# Altium schematic sheet qspi-flash.SchDoc
size A
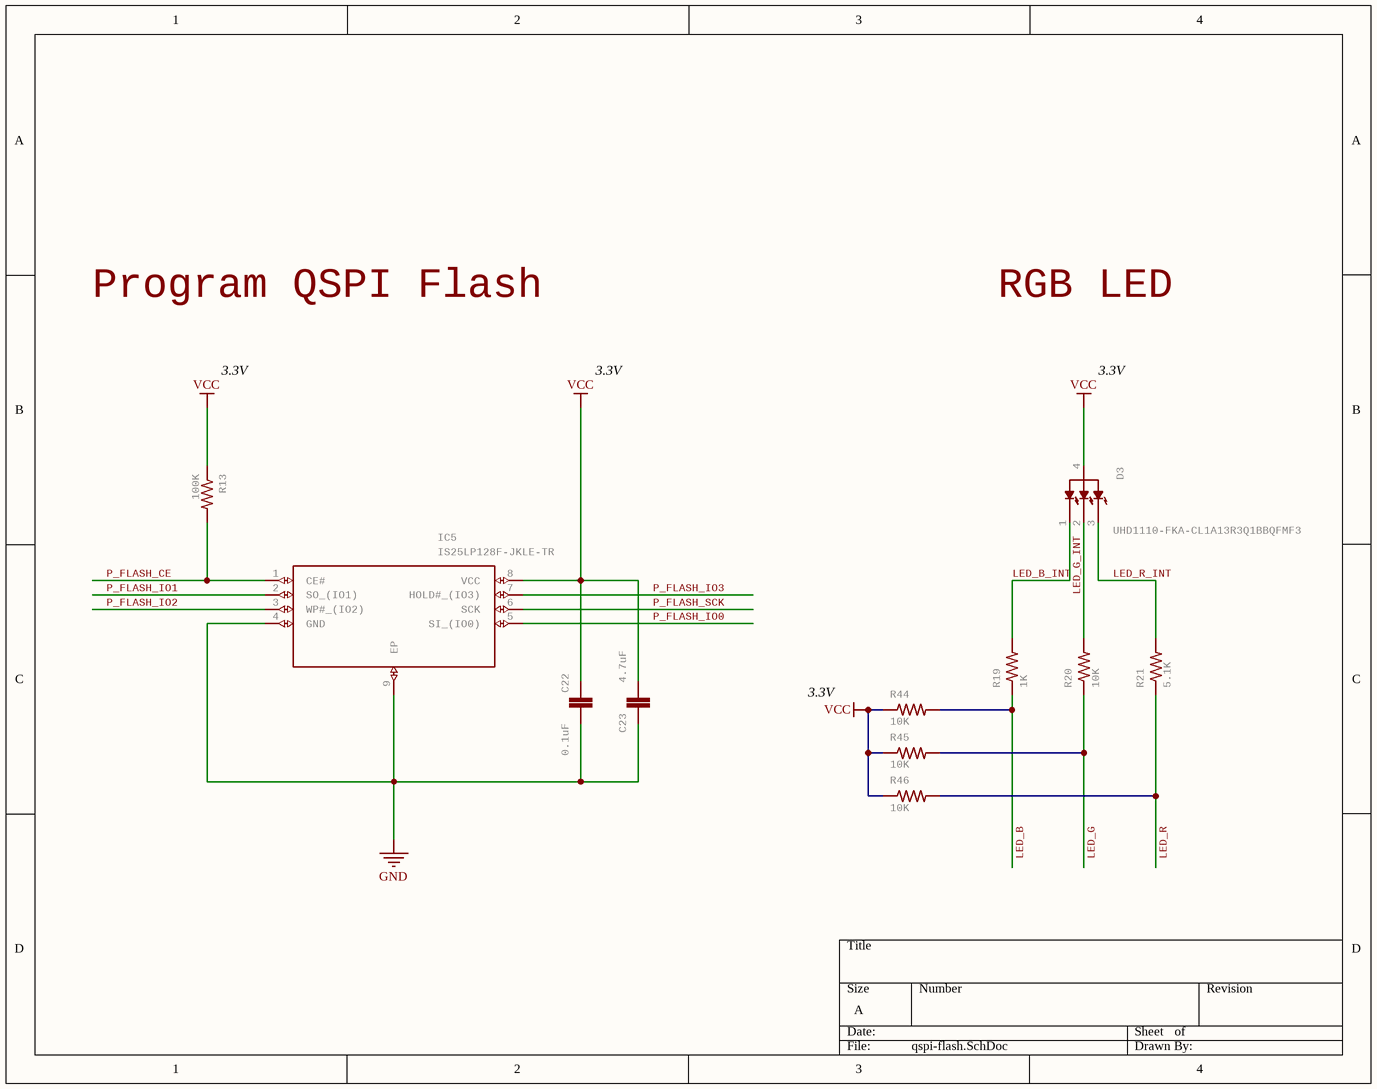
[diagram p0: qspi-flash.SchDoc]

## Parts
C22  0.1uF  [0402-CAP]
C23  4.7uF  [0402-CAP]
D3  UHD1110-FKA-CL1A13R3Q1BBQFMF3  [LED_UHD1110-FKA-CL1A13R3Q1BBQFMF3]
IC5  IS25LP128F-JKLE-TR  [SON127P500X595X80-9N]
R13  100K  [0402-RES]
R19  1K  [0402-RES]
R20  10K  [0402-RES]
R21  5.1K  [0402-RES]
R44  10K  [0402-RES]
R45  10K  [0402-RES]
R46  10K  [0402-RES]

## Nets
GND: C22.2 C23.1 IC5.4(GND) IC5.9(EP)
VCC: C22.1 C23.2 D3.4(ANODE) IC5.8(VCC) R13.1 R44.1 R45.1 R46.1
LED_B: R19.1 R44.2
LED_B_INT: D3.1(BLUE) R19.2
LED_G: R20.1 R45.2
LED_G_INT: D3.2(GREEN) R20.2
LED_R: R21.1 R46.2
LED_R_INT: D3.3(RED) R21.2
P_FLASH_CE: IC5.1(CE#) R13.2
P_FLASH_IO0: IC5.5(SI_(IO0))
P_FLASH_IO1: IC5.2(SO_(IO1))
P_FLASH_IO2: IC5.3(WP#_(IO2))
P_FLASH_IO3: IC5.7(HOLD#_(IO3))
P_FLASH_SCK: IC5.6(SCK)

## Notes on the sheet
- Program QSPI Flash
- RGB LED
- 3.3V

## Library data of the parts
C22 = C-EUC0201: CAPACITOR, European symbol; MPN: C0402C104Z4VAC; GateName_1: G$1; SymbolName_1: C-EU; POPULARITY: 0; LibraryName: rcl; DeviceSetName: C-EU; SPICEPREFIX: C; Part Number: C0402C104Z4VAC
C23 = CAP0402-CAP: CapacitorStandard 0603 ceramic capacitor, and 0.1" leaded capacitor.; MPN: JMK105BBJ475MV-F; GateName_1: G$1; SymbolName_1: CAP; DeviceName: 0402-CAP; LibraryName: sfe; DeviceSetName: CAP; Part Number: JMK105BBJ475MV-F
D3 = UHD1110-FKA-CL1A13R3Q1BBQFMF3: LED RGB SMD, SIZE 1 X 1 mm Check availability; GateName_1: G$1; MF: Cree Inc.; SymbolName_1: UHD1110-FKA-CL1A13R3Q1BBQFMF3; LibraryName: UHD1110-FKA-CL1A13R3Q1BBQFMF3; DeviceSetName: UHD1110-FKA-CL1A13R3Q1BBQFMF3; AVAILABILITY: In Stock; MP: UHD1110-FKA-CL1A13R3Q1BBQFMF3; MPN: UHD1110-FKA-CL1A13r3q1BBQFMF3; PACKAGE: 0404 Cree Inc.; PRICE: None; PURCHASE-URL: https://pricing.snapeda.com/search/part/UHD1110-FKA-CL1A13R3Q1BBQFMF3/?ref=eda; Part Number: UHD1110-FKA-CL1A13r3q1BBQFMF3
IC5 = IS25LP128F-JKLE-TR: NOR Flash 128M 2.3-3.6V 166Mhz Serial NOR Flash   Source:  Datasheet; MANUFACTURER_NAME: Integrated Silicon Solution Inc.; GateName_1: G$1; SymbolName_1: IS25LP128F-JKLE-TR; LibraryName: IS25LP128F-JKLE-TR; DeviceSetName: IS25LP128F-JKLE-TR; HEIGHT: 0.8mm; MANUFACTURER_PART_NUMBER: IS25LP128F-JKLE-TR; MOUSER_PART_NUMBER: 870-IS25LP128F-JKLE-TR; MOUSER_PRICE-STOCK: https://www.mouser.com/ProductDetail/ISSI/IS25LP128F-JKLE-TR?qs=F5EMLAvA7IC8MN2X519UUw%3D%3D&gclid=CjwKCAjwsvujBhAXEiwA_UXnABLUJpl9weydWRO2l8Lx1K-mg-pZDVt8AO_chLaXpBnEcozZukFcOxoCxuIQAvD_BwE; MPN: IS25LP128F-JKLE-TR
R13 = RESISTOR0402-RES: ResistorBasic schematic elements and footprints for 0603, 1206, and PTH resistors.; MPN: AC0402FR-07100KL; GateName_1: G$1; SymbolName_1: RESISTOR; DeviceName: 0402-RES; LibraryName: sfe; DeviceSetName: RESISTOR; Part Number: AC0402FR-07100KL
R19 = RESISTOR0402-RES: ResistorBasic schematic elements and footprints for 0603, 1206, and PTH resistors.; MPN: CRCW04021K00FKEDC; GateName_1: G$1; SymbolName_1: RESISTOR; DeviceName: 0402-RES; LibraryName: sfe; DeviceSetName: RESISTOR; Part Number: CRCW04021K00FKEDC
R20 R44-R46 = RESISTOR0402-RES: ResistorBasic schematic elements and footprints for 0603, 1206, and PTH resistors.; MPN: AC0402FR-1310KL; GateName_1: G$1; SymbolName_1: RESISTOR; DeviceName: 0402-RES; LibraryName: sfe; DeviceSetName: RESISTOR; Part Number: AC0402FR-1310KL
R21 = RESISTOR0402-RES: ResistorBasic schematic elements and footprints for 0603, 1206, and PTH resistors.; MPN: RC0402JR-075K1L; GateName_1: G$1; SymbolName_1: RESISTOR; DeviceName: 0402-RES; LibraryName: sfe; DeviceSetName: RESISTOR; Part Number: RC0402JR-075K1L